# Altium schematic sheet gps.SchDoc
size A4; SheetNumber: 6; SheetTotal: 10
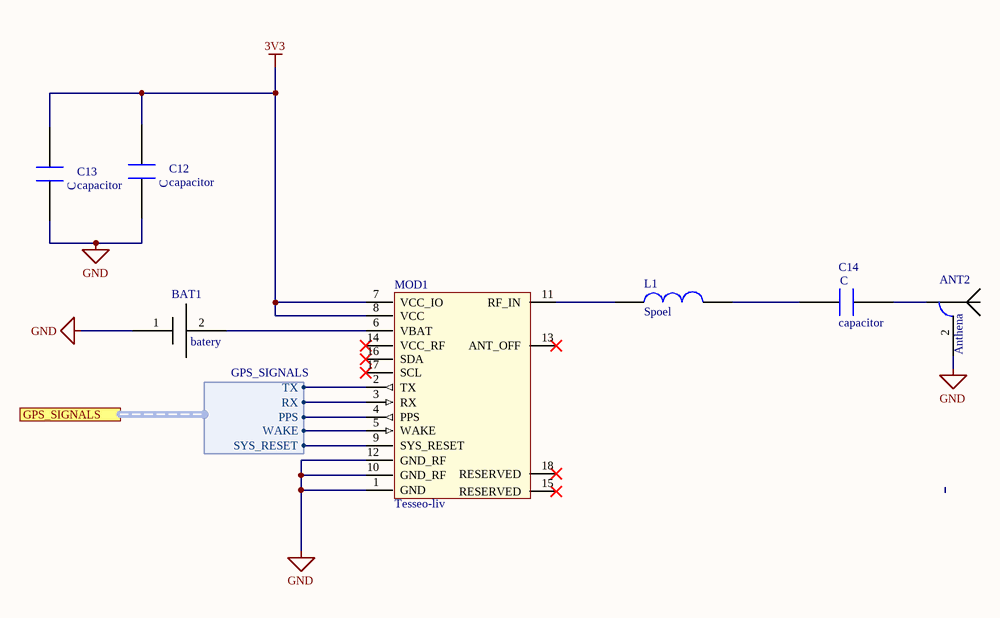
[diagram p0: gps.SchDoc]

## Parts
ANT2  Anthena
BAT1  batery
C12  capacitor  [CAPC1005X04L]
C13  capacitor  [CAPC1005X04L]
C14  capacitor  [CAPC1005X04L]
L1  Spoel  [Coilcraft , XFL4020-102]
MOD1  Tesseo-liv

## Ports
GPS_SIGNALS (harness GPS_SIGNALS)

## Harnesses
GPS_SIGNALS: TX, RX, PPS, WAKE, SYS_RESET

## Nets
3V3: C12.1 C13.1 MOD1.7(VCC_IO) MOD1.8(VCC)
GND: ANT2.2 BAT1.1 C12.2 C13.2 MOD1.1(GND) MOD1.10(GND_RF) MOD1.12(GND_RF)
NetANT2_1: ANT2.1 C14.1
NetBAT1_2: BAT1.2 MOD1.6(VBAT)
NetC14_2: C14.2 L1.1
NetL1_2: L1.2 MOD1.11(RF_IN)
NetMOD1_2: MOD1.2(TX) ; port GPS_SIGNALS.TX
NetMOD1_3: MOD1.3(RX) ; port GPS_SIGNALS.RX
NetMOD1_4: MOD1.4(PPS) ; port GPS_SIGNALS.PPS
NetMOD1_5: MOD1.5(WAKE) ; port GPS_SIGNALS.WAKE
NetMOD1_9: MOD1.9(SYS_RESET) ; port GPS_SIGNALS.SYS_RESET

Not connected (* = marked no-connect by the designer): MOD1 13(ANT_OFF)* 14(VCC_RF)* 15(RESERVED)* 16(SDA)* 17(SCL)* 18(RESERVED)*

## Notes on the sheet
- (in symbol capacitor) C